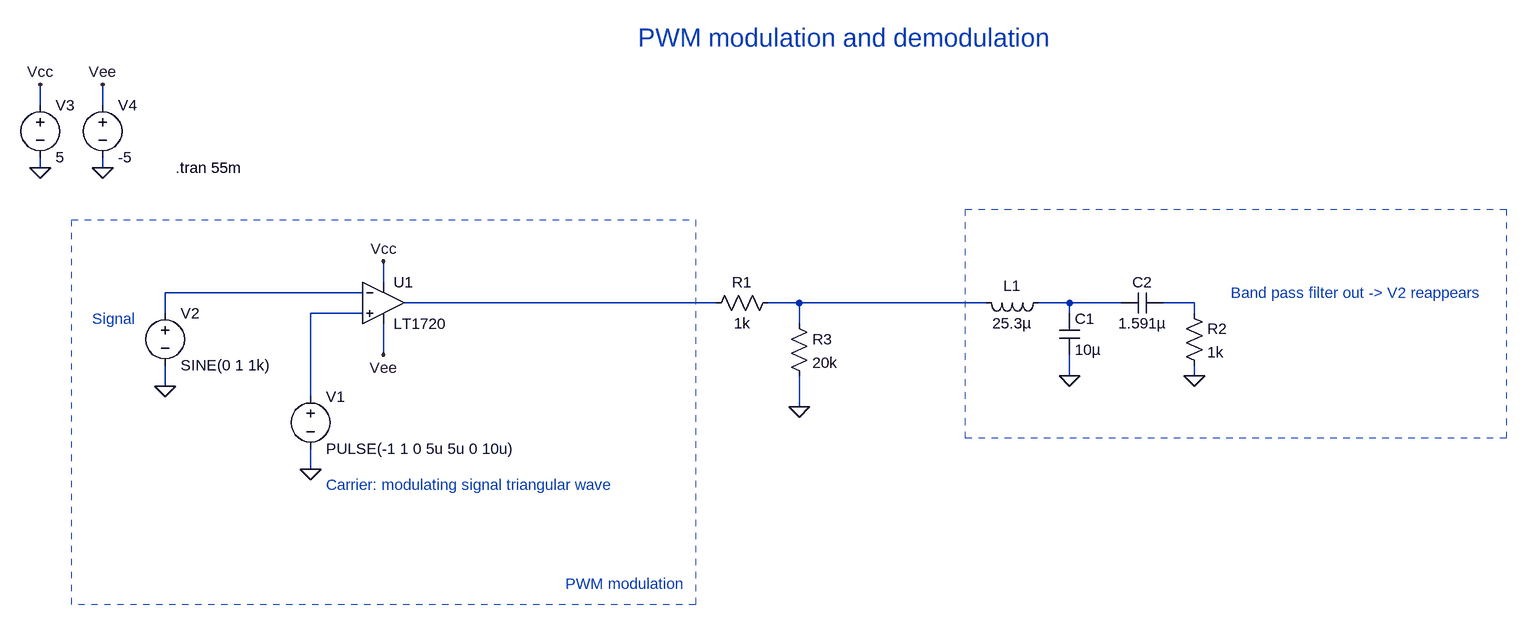
[diagram p0: schematic PWM-modulation.asc]
PWM-modulation.asc, the LTspice schematic file:
Version 4
SHEET 1 1972 680
WIRE -288 -336 -288 -368
WIRE -192 -336 -192 -368
WIRE -288 -240 -288 -256
WIRE -192 -240 -192 -256
WIRE 240 -64 240 -96
WIRE 208 -48 -96 -48
WIRE 752 -32 272 -32
WIRE 880 -32 832 -32
WIRE 1168 -32 880 -32
WIRE 1296 -32 1248 -32
WIRE 1376 -32 1296 -32
WIRE 1488 -32 1440 -32
WIRE -96 -16 -96 -48
WIRE 208 -16 128 -16
WIRE 1296 -16 1296 -32
WIRE 1488 -16 1488 -32
WIRE 880 0 880 -32
WIRE 240 48 240 0
WIRE 1296 80 1296 48
WIRE 1488 80 1488 64
WIRE -96 96 -96 64
WIRE 128 112 128 -16
WIRE 880 128 880 80
WIRE 128 224 128 192
FLAG 128 224 0
FLAG -96 96 0
FLAG -288 -240 0
FLAG -192 -240 0
FLAG 240 -96 Vcc
FLAG -288 -368 Vcc
FLAG 240 48 Vee
FLAG -192 -368 Vee
FLAG 1296 80 0
FLAG 1488 80 0
FLAG 880 128 0
SYMBOL voltage 128 96 R0
WINDOW 123 0 0 Left 0
WINDOW 39 0 0 Left 0
SYMATTR InstName V1
SYMATTR Value PULSE(-1 1 0 5u 5u 0 10u)
SYMBOL voltage -96 -32 R0
WINDOW 123 0 0 Left 0
WINDOW 39 0 0 Left 0
SYMATTR InstName V2
SYMATTR Value SINE(0 1 1k)
SYMBOL Comparators\\LT1720 240 -96 R0
SYMATTR InstName U1
SYMBOL voltage -288 -352 R0
WINDOW 123 0 0 Left 0
WINDOW 39 0 0 Left 0
SYMATTR InstName V3
SYMATTR Value 5
SYMBOL voltage -192 -352 R0
WINDOW 123 0 0 Left 0
WINDOW 39 0 0 Left 0
SYMATTR InstName V4
SYMATTR Value -5
SYMBOL ind 1264 -48 R90
WINDOW 0 5 56 VBottom 2
WINDOW 3 32 56 VTop 2
SYMATTR InstName L1
SYMATTR Value 25.3µ
SYMBOL cap 1280 -16 R0
SYMATTR InstName C1
SYMATTR Value 10µ
SYMBOL cap 1440 -48 R90
WINDOW 0 0 32 VBottom 2
WINDOW 3 32 32 VTop 2
SYMATTR InstName C2
SYMATTR Value 1.591µ
SYMBOL res 1472 -32 R0
SYMATTR InstName R2
SYMATTR Value 1k
SYMBOL res 736 -16 R270
WINDOW 0 32 56 VTop 2
WINDOW 3 0 56 VBottom 2
SYMATTR InstName R1
SYMATTR Value 1k
SYMBOL res 864 -16 R0
SYMATTR InstName R3
SYMATTR Value 20k
TEXT -80 -240 Left 2 !.tran 55m
TEXT 1544 -48 Left 2 ;Band pass filter out -> V2 reappears
TEXT 152 248 Left 2 ;Carrier: modulating signal triangular wave
TEXT -208 -8 Left 2 ;Signal
TEXT 520 400 Left 2 ;PWM modulation
TEXT 632 -440 Left 4 ;PWM modulation and demodulation
RECTANGLE Normal 1968 176 1136 -176 2
RECTANGLE Normal 720 432 -240 -160 2

The netlist it stands for:
* PWM-modulation.asc
V1 N006 0 PULSE(-1 1 0 5u 5u 0 10u)
V2 N001 0 SINE(0 1 1k)
XU1 N006 N001 Vcc Vee N002 LT1720  ; pins In+ In- V+ V- OUT
V3 Vcc 0 5
V4 Vee 0 -5
L1 N004 N003 25.3µ
C1 N004 0 10µ
C2 N005 N004 1.591µ
R2 N005 0 1k
R1 N002 N003 1k
R3 N003 0 20k
.tran 55m
* Band pass filter out -> V2 reappears
* Carrier: modulating signal triangular wave
* Signal
* PWM modulation
* PWM modulation and demodulation
.lib LT1720.sub
.backanno
.end